# Altium project Safety.PrjPCB
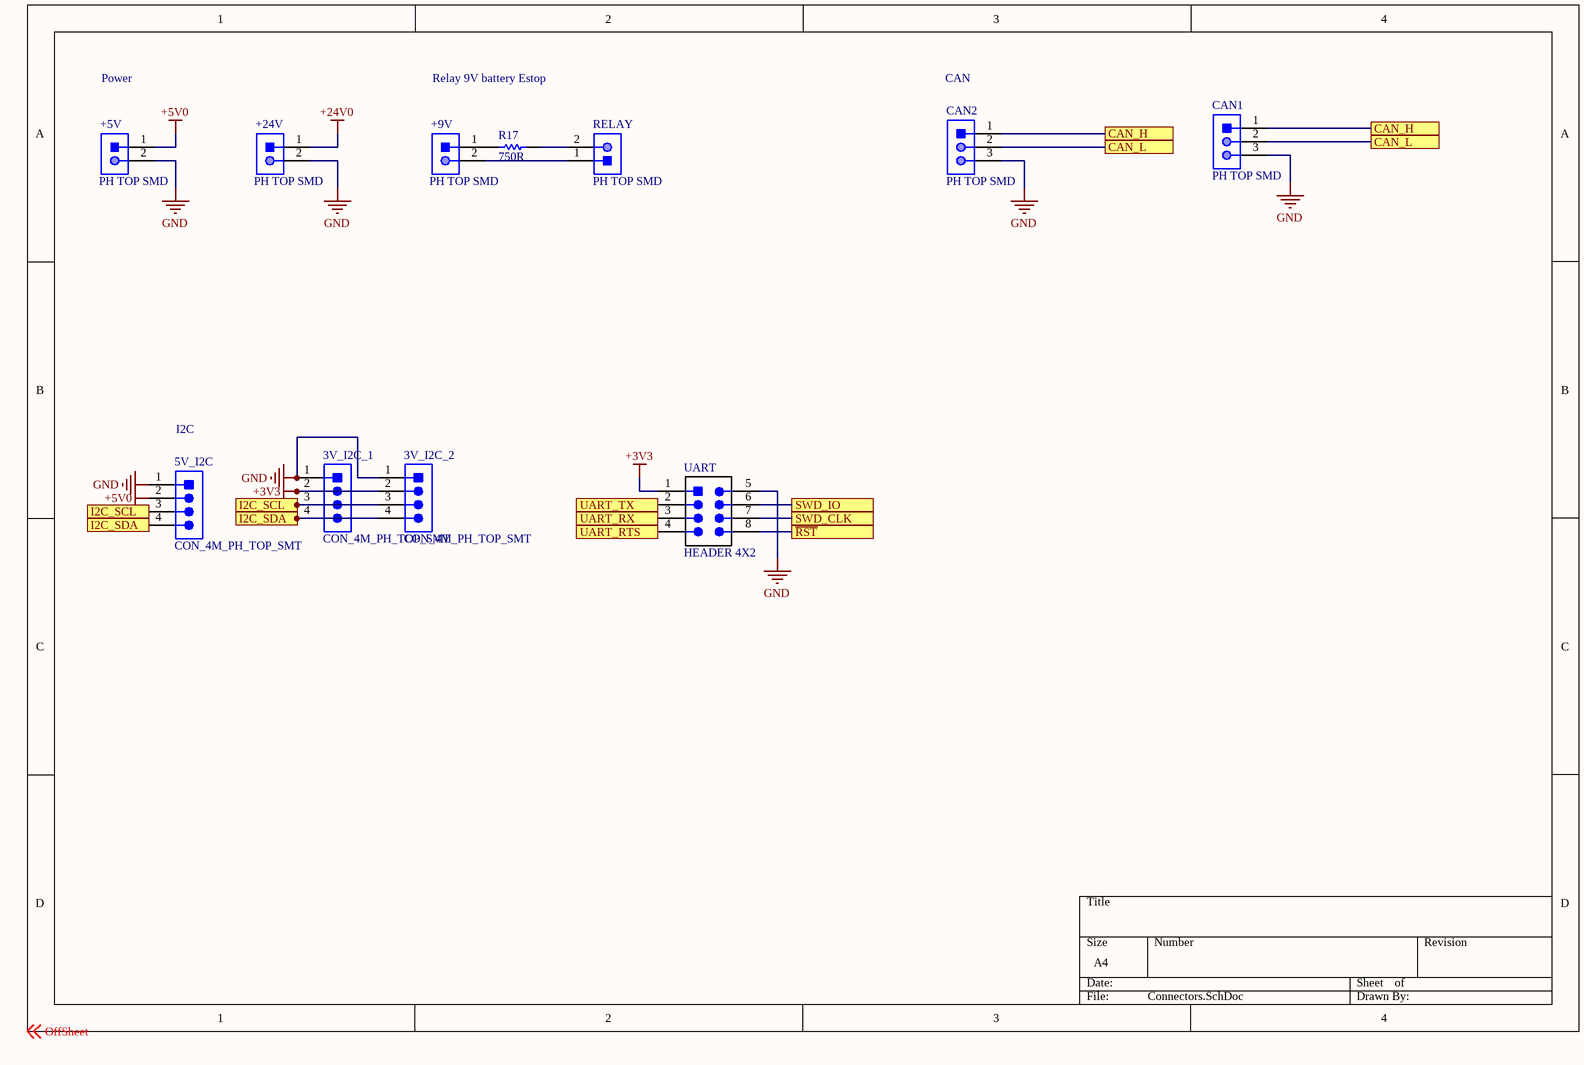
[diagram p0: Connectors.SchDoc]
2 sheets, 20 parts. Net scope: flat (ports and power ports of the same name join across sheets).
Board file: Safety_rev1.PcbDoc
Sheets:
  Connectors.SchDoc
  POWER.SchDoc

## Sheet Connectors.SchDoc
size A4

### Parts
3V_I2C_1  CON_4M_PH_TOP_SMT  [JST-B4B-SM4-TB]
3V_I2C_2  CON_4M_PH_TOP_SMT  [JST-B4B-SM4-TB]
5V_I2C  CON_4M_PH_TOP_SMT  [JST-B4B-SM4-TB]
+5V  PH TOP SMD  [JST-B2B-SM4-TB]
+9V  PH TOP SMD  [JST-B2B-SM4-TB]
+24V  PH TOP SMD  [JST-B2B-SM4-TB]
CAN1  PH TOP SMD  [JST-B3B-SM4-TB]
CAN2  PH TOP SMD  [JST-B3B-SM4-TB]
R17  value 750R  [RESC0603(1608)_N]  (hidden comment: RES_750R_0603)
RELAY  PH TOP SMD  [JST-B2B-SM4-TB]
UART  HEADER 4X2  [HEADER_2X4]

### Ports
CAN_H, CAN_L, I2C_SCL, I2C_SDA, SWD_CLK, SWD_IO, UART_RTS, UART_RX, UART_TX, ~{RST}

### Nets
+3V3: 3V_I2C_1.2 3V_I2C_2.2 UART.1(VCC)
+5V0: 5V_I2C.2 +5V.1
+24V0: +24V.1
GND: 3V_I2C_1.1 3V_I2C_2.1 5V_I2C.1 +5V.2 +24V.2 CAN1.3 CAN2.3 UART.5(GND)
Net3V_I2C_1_3: 3V_I2C_1.3 3V_I2C_2.3 5V_I2C.3 ; port I2C_SCL
Net3V_I2C_1_4: 3V_I2C_1.4 3V_I2C_2.4 5V_I2C.4 ; port I2C_SDA
Net+9V_1: +9V.1 R17.1
Net+9V_2: +9V.2 RELAY.1
NetCAN1_1: CAN1.1 CAN2.1 ; port CAN_H
NetCAN1_2: CAN1.2 CAN2.2 ; port CAN_L
NetR17_2: R17.2 RELAY.2
NetUART_2: UART.2 ; port UART_TX
NetUART_3: UART.3 ; port UART_RX
NetUART_4: UART.4 ; port UART_RTS
NetUART_6: UART.6 ; port SWD_IO
NetUART_7: UART.7 ; port SWD_CLK
NetUART_8: UART.8 ; port ~{RST}

### Notes on the sheet
- Power
- Relay 9V battery Estop
- (near CAN2) CAN
- (near 5V_I2C) I2C
- Labels drawn without touching a wire or pin: OffSheet

### Library data of the parts
3V_I2C_1 3V_I2C_2 5V_I2C = CON_4M_PH_TOP_SMT: CONN HEADER PH TOP 4POS 2MM SMD; Manufacturer: JST; MPN: B4B-PH-SM4-TB(LF)(SN); ComponentLink1Description: Datasheet; ComponentLink1URL: http://www.jst-mfg.com/product/pdf/eng/ePH.pdf; Digikey Part Number: 455-1736-1-ND
+5V +9V +24V RELAY = CON_2M_PH_TOP_SMT: CONN HEADER PH TOP 2POS 2MM SMD; Manufacturer: JST; Part Number: B2B-PH-SM4-TB; ComponentLink1Description: Datasheet; ComponentLink1URL: http://www.jst-mfg.com/product/pdf/eng/ePH.pdf
CAN1 CAN2 = CON_3M_PH_TOP_SMT: CONN HEADER PH TOP 3POS 2MM SMD; Manufacturer: JST; Part Number: B3B-PH-SM4-TB; ComponentLink1Description: Datasheet; ComponentLink1URL: http://www.jst-mfg.com/product/pdf/eng/ePH.pdf
R17 = RES_750R_0603: RES SMD 750 OHM 0.5% 1/10W 0603; Manufacturer: Yageo; MPN: RC0603JR-07750RL; Tolerance: 5%; Package: 0603 (1608 Metric); Dimensions: 0.063" L x 0.031" W (1.60mm x 0.80mm); Digikey Part Number: 311-750GRCT-ND
UART = HEADER 4X2: Header, 4-Pin Dual row; LatestRevisionDate: 17-Jul-2002; LatestRevisionNote: Re-released for DXP Platform.; Publisher: Altium Limited

## Sheet POWER.SchDoc
size A4
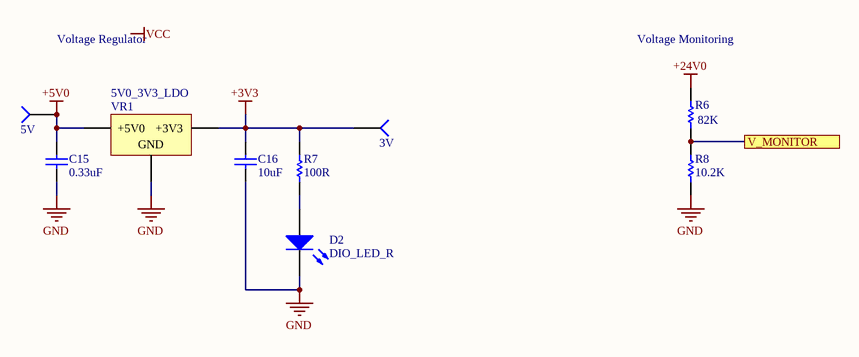
[diagram p1: POWER.SchDoc]

### Parts
2  5V  [TESTPOINT]
C15  value 0.33uF  [CAPC0603(1608)55_N]  (hidden comment: CAP_0.33uF_16V_0603)
C16  value 10uF  [CAPC0603(1608)55_N]  (hidden comment: CAP_10uF_0603)
D2  DIO_LED_R  [LED_0805_LINE]
R6  value 82K  [RESC0603(1608)_N]  (hidden comment: RES_82K_0603)
R7  value 100R  [RESC0603(1608)_N]  (hidden comment: RES_100R_0603)
R8  value 10.2K  [RESC0603(1608)_N]  (hidden comment: RES_10.2K_0603)
TP6  3V  [TESTPOINT]
VR1  5V0_3V3_LDO  [VOLTAGE_REGULATOR]

### Ports
V_MONITOR

### Nets
+3V3: C16.2 R7.2 TP6.1(=value) VR1.4(+3V3)
+5V0: 2.1(=value) C15.2 VR1.3(+5V0)
+24V0: R6.2
GND: C15.1 C16.1 D2.2(K) R8.1 VR1.1(GND)
NetD2_1: D2.1(A) R7.1
NetR6_1: R6.1 R8.2 ; port V_MONITOR

### Notes on the sheet
- Voltage Regulator
- Voltage Monitoring
- Labels drawn without touching a wire or pin: VCC

### Library data of the parts
2 TP6 = TESTPOINT_SMD: Part Number (MPN): *
C15 = CAP_0.33uF_16V_0603: CAP CER 0.33UF 16V X7R 0603; Part Number: GRM188R71C334KA01D; Manufacturer: Murata Electronics North America; Dimensions: 0.063" L x 0.031" W (1.60mm x 0.80mm); Package: 0603 (1608 Metric); Temperature Coefficient: X7R; Voltage Rating: 16V
C16 = CAP_10uF_0603: CAP CER 10UF 10V X5R 0603; Part Number: CC0603MRX5R6BB106; Manufacturer: Yageo; Dimensions: 0.063" L x 0.031" W (1.60mm x 0.80mm); Package: 0603 (1608 Metric); Temperature Coefficient: X5R; Voltage Rating: 10V
D2 = DIO_LED_R: LED RED DIFFUSED 0805 SMD; Part Number: LS R976-NR-1; Manufacturer: OSRAM; Forward Voltage Drop: 2V; Package: 0805 (2012 Metric)
R6 = RES_634K_0603: RES SMD 82K OHM 1% 1/10W 0603; Manufacturer: Yageo; Part Number (MPN): RC0603FR-07634KL; Package: 0603 (1608 Metric); Dimensions: 0.063" L x 0.031" W (1.60mm x 0.80mm); Tolerance: 1%; Digikey Part Number: 311-634KHRCT-ND
R7 = RES_100R_0603: RES SMD 100 OHM 1% 1/10W 0603; Manufacturer: Yageo; Part Number (MPN): RC0603FR-07100RL; Package: 0603 (1608 Metric); Dimensions: 0.063" L x 0.031" W (1.60mm x 0.80mm); Tolerance: 1%
R8 = RES_100K_0603: RES SMD 10.2K OHM 5% 1/10W 0603; Manufacturer: Yageo; Part Number (MPN): RC0603FR-07261KL; Package: 0603 (1608 Metric); Dimensions: 0.063" L x 0.031" W (1.60mm x 0.80mm); Tolerance: 5%; Digikey Part Number: 311-261KHRCT-ND
VR1 = 5V0_3V3_LDO: IC REG LINEAR 3.3V 1A DPAK; Part Number: NCP1117DT33T5G; Manufacturer: ON Semiconductor; Current Output: 1A

## Nets that join several sheets
+3V3: Connectors (3V_I2C_1.2 3V_I2C_2.2 UART.1), POWER (C16.2 R7.2 TP6.1 VR1.4)
+5V0: Connectors (5V_I2C.2 +5V.1), POWER (2.1 C15.2 VR1.3)
+24V0: Connectors (+24V.1), POWER (R6.2)
GND: Connectors (8 pins), POWER (5 pins)